# Altium schematic sheet Sensors_Sheet.SchDoc
size A3; SheetNumber: 5; SheetTotal: 5
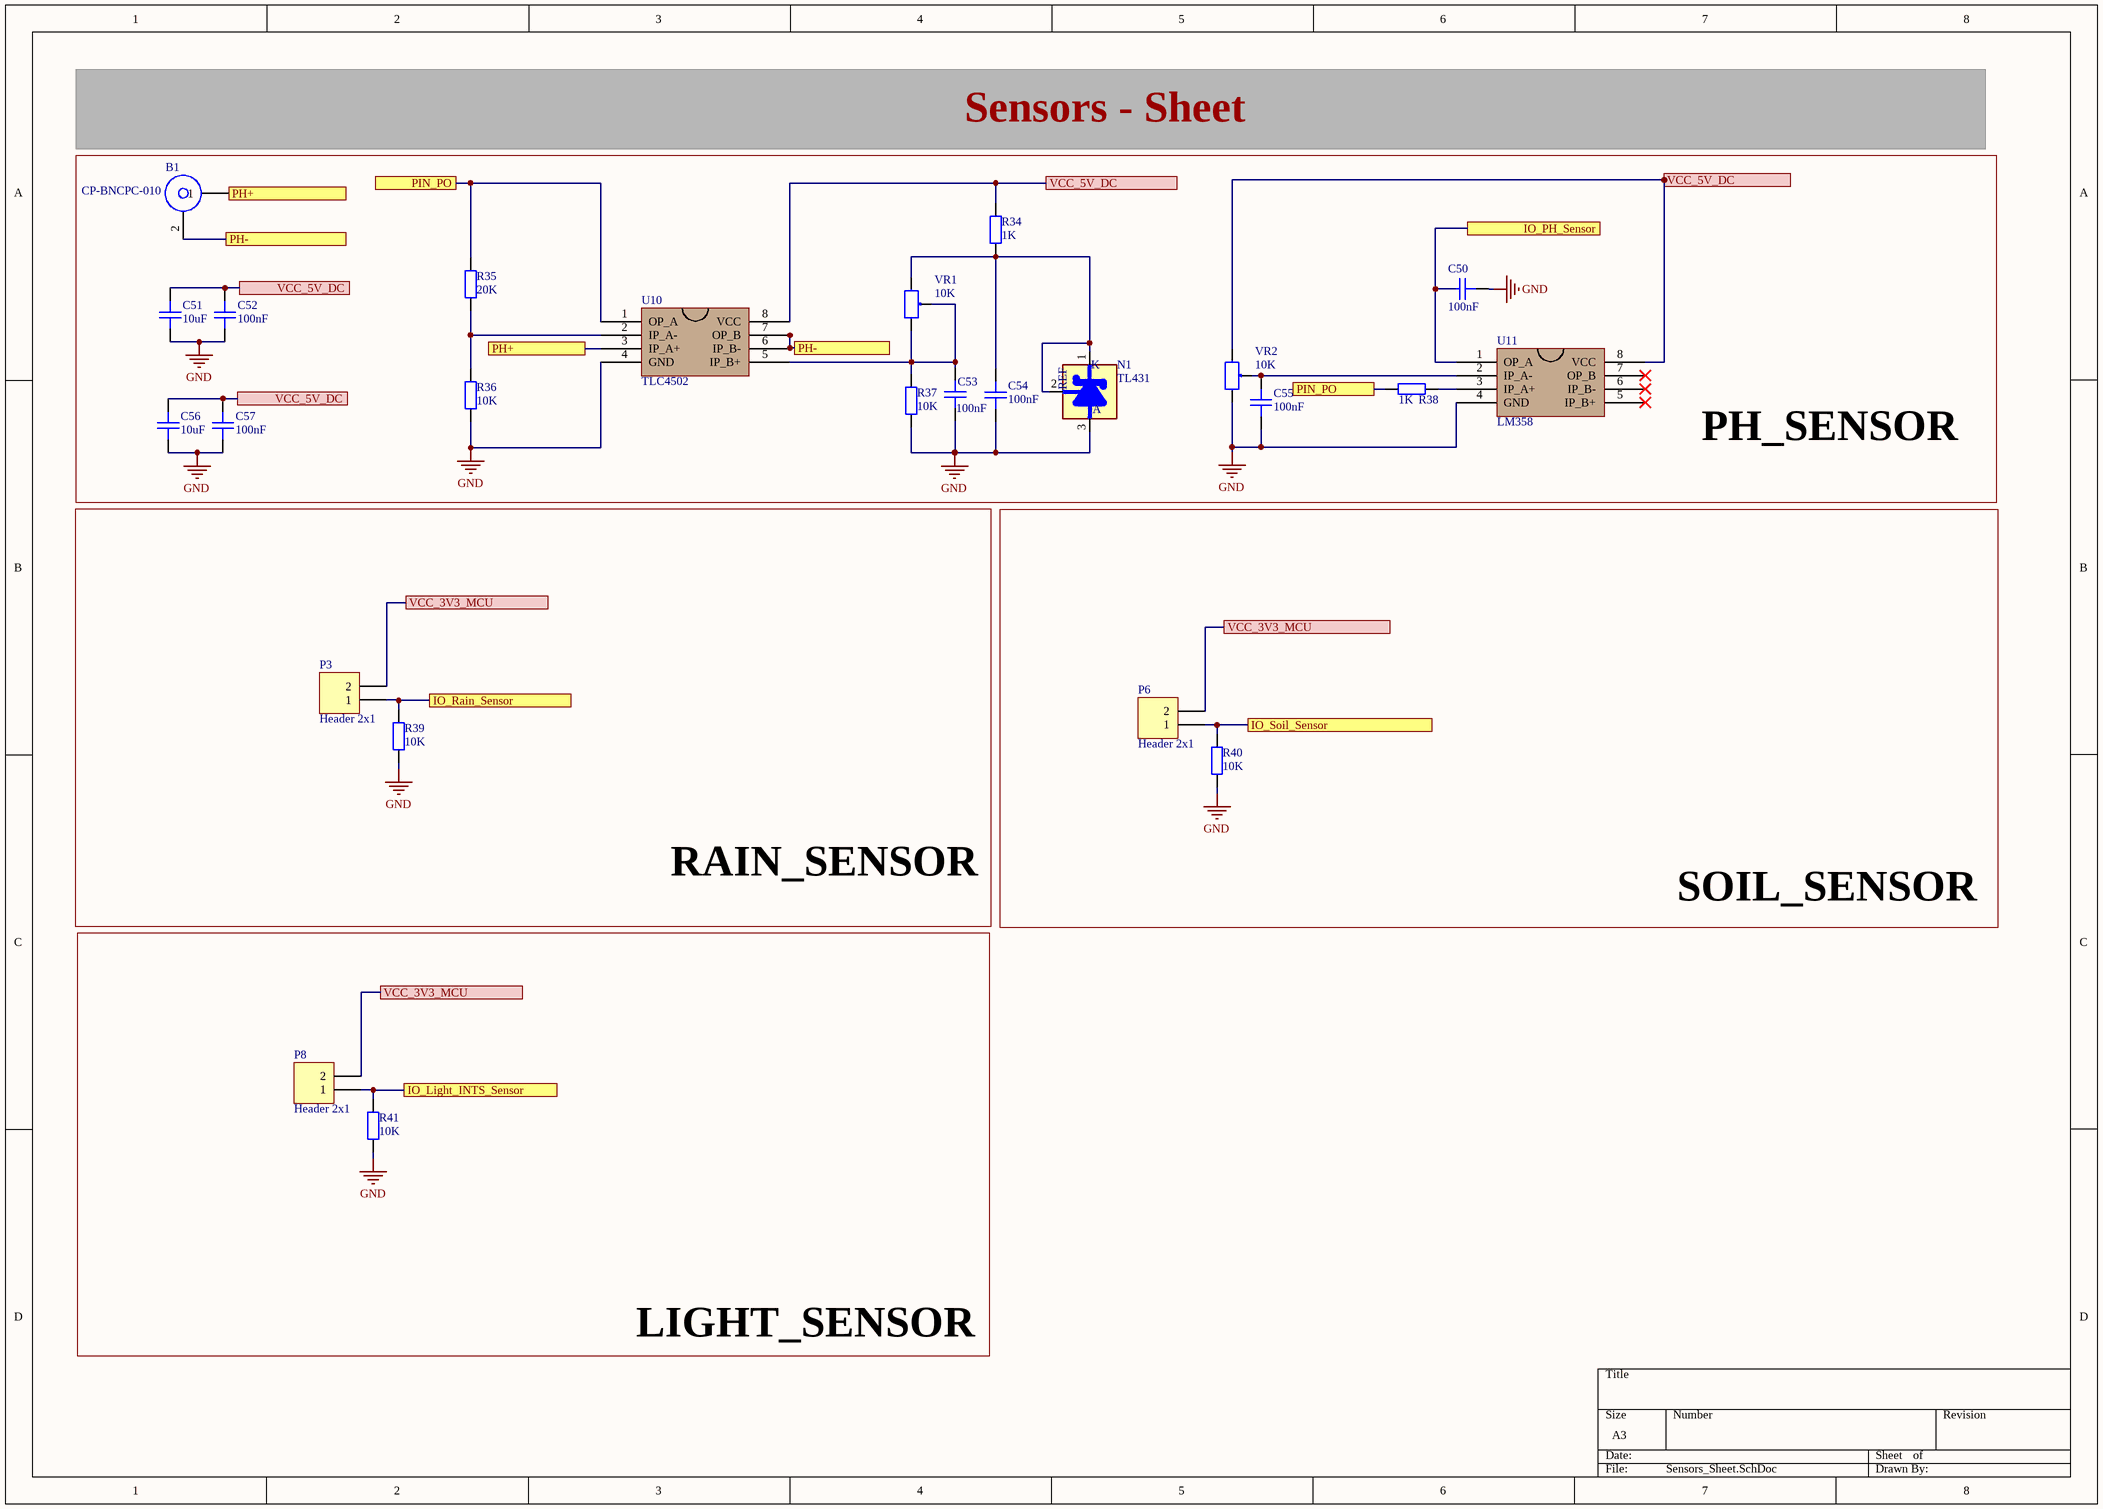
[diagram p0: Sensors_Sheet.SchDoc]

## Parts
B1  CP-BNCPC-010  [BNC]
C50  100nF  [CAPC-0603 (1608)]
C51  10uF  [CAPC-0603 (1608)]
C52  100nF  [CAPC-0603 (1608)]
C53  100nF  [CAPC-0603 (1608)]
C54  100nF  [CAPC-0603 (1608)]
C55  100nF  [CAPC-0603 (1608)]
C56  10uF  [CAPC-0603 (1608)]
C57  100nF  [CAPC-0603 (1608)]
N1  TL431  [SOT323]
P3  Header 2x1  [HDR1X2]
P6  Header 2x1  [HDR1X2]
P8  Header 2x1  [HDR1X2]
R34  1K  [RESC-0603 (1608)]
R35  20K  [RESC-0603 (1608)]
R36  10K  [RESC-0603 (1608)]
R37  10K  [RESC-0603 (1608)]
R38  1K  [RESC-0603 (1608)]
R39  10K  [RESC-0603 (1608)]
R40  10K  [RESC-0603 (1608)]
R41  10K  [RESC-0603 (1608)]
U10  TLC4502  [TLC4502]
U11  LM358  [LM358]
VR1  10K  [VR1]
VR2  10K  [VR1]

## Blocks framed on the sheet
PH_SENSOR: B1 C50-C57 N1 R34-R38 U10 U11 VR1 VR2
RAIN_SENSOR: P3 R39
SOIL_SENSOR: P6 R40
LIGHT_SENSOR: P8 R41

## Ports
IO_Light_INTS_Sensor, IO_PH_Sensor, IO_Rain_Sensor, IO_Soil_Sensor, PH+, PH-, PIN_PO, VCC_3V3_MCU, VCC_5V_DC

## Nets
GND: C50.1 C51.1 C52.1 C53.1 C54.1 C55.1 C56.1 C57.1 N1.3(A) R36.1 R37.1 R39.1 R40.1 R41.1 U10.4(GND) U11.4(GND) VR2.3
IO_Light_INTS_Sensor: P8.1 R41.2 ; port IO_Light_INTS_Sensor
IO_PH_Sensor: C50.2 U11.1(OP_A) ; port IO_PH_Sensor
IO_Rain_Sensor: P3.1 R39.2 ; port IO_Rain_Sensor
IO_Soil_Sensor: P6.1 R40.2 ; port IO_Soil_Sensor
PH+: B1.1 U10.3(IP_A+) ; port PH+
PH-: B1.2 U10.6(IP_B-) U10.7(OP_B) ; port PH-
PIN_PO: R35.2 R38.2 U10.1(OP_A) ; port PIN_PO
VCC_3V3_MCU: P3.2 P6.2 P8.2 ; port VCC_3V3_MCU
VCC_5V_DC: C51.2 C52.2 C56.2 C57.2 R34.2 U10.8(VCC) U11.8(VCC) VR2.1 ; port VCC_5V_DC
NetC53_2: C53.2 R37.2 U10.5(IP_B+) VR1.2 VR1.3
NetC54_2: C54.2 N1.1(K) N1.2(REF) R34.1 VR1.1
NetC55_2: C55.2 U11.2(IP_A-) VR2.2
NetR35_1: R35.1 R36.2 U10.2(IP_A-)
NetR38_1: R38.1 U11.3(IP_A+)

Not connected (* = marked no-connect by the designer): U11 5(IP_B+)* 6(IP_B-)* 7(OP_B)*

## Notes on the sheet
- Sensors - Sheet

## Library data of the parts
C50-C57 = CAPC NF 0603: CAP SMD, Not Fill, 0603; Value: NF; Solder: Not Fill; Category: CAPACITOR
N1 = TL431: IC VREF SHUNT ADJ 0.4% TO92-3; MF: onsemi; SnapEDA_Link: https://www.snapeda.com/parts/TL431/Onsemi/view-part/?ref=snap; Package: None; Value: *; MP: TL431; Check_prices: https://www.snapeda.com/parts/TL431/Onsemi/view-part/?ref=eda
P3 P6 P8 = Header 2x1: Header, 2-Pin, pitch 2.54mm; Solder: WAVE
R34-R41 = CRCW06035R10FKEA: RES SMD 5.1 OHM 1% 1/10W 0603; MFR: Vishay Dale; Value: 5.1R; Solder: SMT; MPN: CRCW06035R10FKEA; Category: RESISTOR; PinCount: 2
U11 = LM358D
VR1 VR2 = VR: Var Resistor; Value: VR 10K